# Altium schematic sheet Indictor.SchDoc
size A4
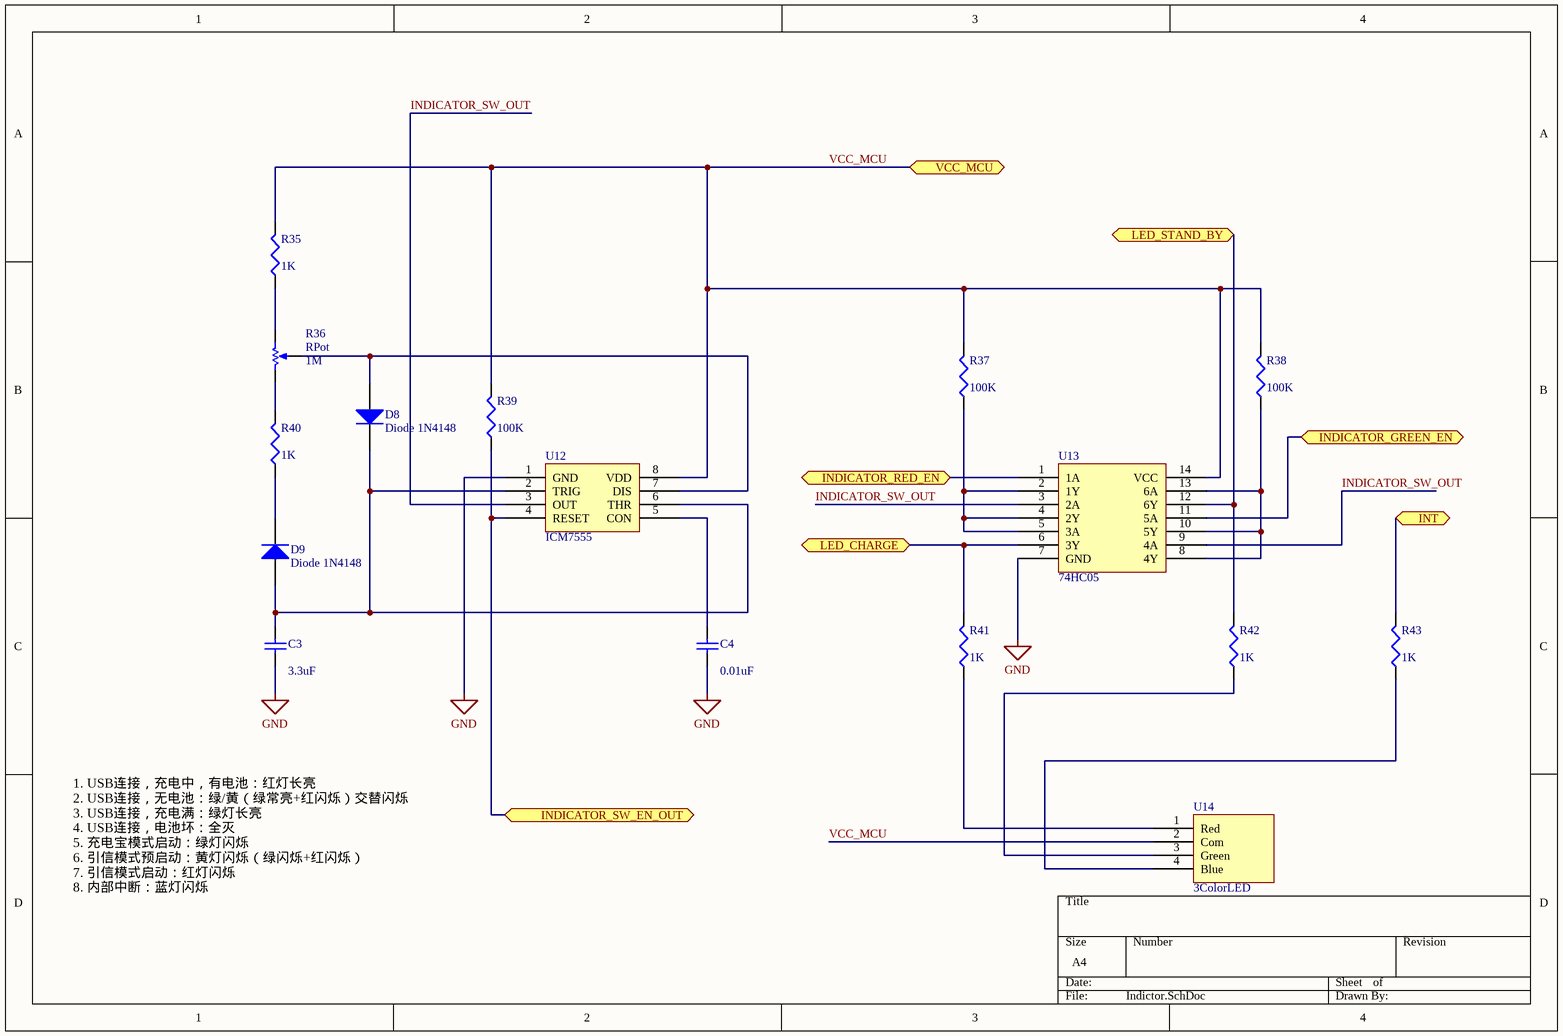
[diagram p0: Indictor.SchDoc]

## Parts
C3  value 3.3uF  [0603]  (hidden comment: Cap Semi)
C4  value 0.01uF  [0603]  (hidden comment: Cap Semi)
D8  Diode 1N4148  [1206D]
D9  Diode 1N4148  [1206D]
R35  value 1K  [0603]  (hidden comment: Res3)
R36  RPot  value 1M  [VR5]
R37  value 100K  [0603]  (hidden comment: Res3)
R38  value 100K  [0603]  (hidden comment: Res3)
R39  value 100K  [0603]  (hidden comment: Res3)
R40  value 1K  [0603]  (hidden comment: Res3)
R41  value 1K  [0603]  (hidden comment: Res3)
R42  value 1K  [0603]  (hidden comment: Res3)
R43  value 1K  [0603]  (hidden comment: Res3)
U12  ICM7555  [SOP8]
U13  74HC05  [TSSOP14]
U14  3ColorLED  [3COLOR-LED]

## Ports
INDICATOR_GREEN_EN (bidir), INDICATOR_RED_EN (bidir), INDICATOR_SW_EN_OUT (bidir), INT (bidir), LED_CHARGE (bidir), LED_STAND_BY (bidir), VCC_MCU (bidir)

## Nets
GND: C3.1 C4.1 U12.1(GND) U13.7(GND)
INDICATOR_GREEN_EN: U13.11(5A) ; port INDICATOR_GREEN_EN
INDICATOR_RED_EN: U13.1(1A) ; port INDICATOR_RED_EN
INDICATOR_SW_EN_OUT: R39.1 U12.4(RESET) ; port INDICATOR_SW_EN_OUT
INDICATOR_SW_OUT: U12.3(OUT) U13.3(2A) U13.9(4A)
INT: R43.2 ; port INT
LED_CHARGE: R41.2 U13.6(3Y) ; port LED_CHARGE
LED_STAND_BY: R42.2 U13.12(6Y) ; port LED_STAND_BY
VCC_MCU: R35.2 R37.2 R38.2 R39.2 U12.8(VDD) U13.14(VCC) U14.2(Com) ; port VCC_MCU
NetC3_2: C3.2 D8.2(K) D9.1(A) U12.2(TRIG) U12.6(THR)
NetC4_2: C4.2 U12.5(CON)
NetD8_1: D8.1(A) R36.3(TAP) U12.7(DIS)
NetD9_2: D9.2(K) R40.1
NetR35_1: R35.1 R36.1(TOP)
NetR36_2: R36.2(BOT) R40.2
NetR37_1: R37.1 U13.2(1Y) U13.4(2Y) U13.5(3A)
NetR38_1: R38.1 U13.8(4Y) U13.10(5Y) U13.13(6A)
NetR41_1: R41.1 U14.1(Red)
NetR42_1: R42.1 U14.3(Green)
NetR43_1: R43.1 U14.4(Blue)

## Notes on the sheet
- 1. USB连接，充电中，有电池：红灯长亮
  2. USB连接，无电池：绿/黄（绿常亮+红闪烁）交替闪烁
  3. USB连接，充电满：绿灯长亮
  4. USB连接，电池坏：全灭
  5. 充电宝模式启动：绿灯闪烁
  6. 引信模式预启动：黄灯闪烁（绿闪烁+红闪烁）
  7. 引信模式启动：红灯闪烁
  8. 内部中断：蓝灯闪烁

## Library data of the parts
C3 C4 = Cap Semi: Capacitor (Semiconductor SIM Model); Published: 8-Jun-2000; LatestRevisionDate: 29-May-2009; LatestRevisionNote: IPC-7351 Footprint Added.; PackageReference: C1206; Publisher: Altium Limited; PackageDescription: Chip Capacitor
D8 D9 = Diode 1N4005: 1 Amp General Purpose Rectifier; Published: 8-Jun-2000; LatestRevisionDate: 17-Jul-2002; LatestRevisionNote: Re-released for DXP Platform.; DatasheetVersion: 1998; PackageVersion: Aug-1999; PackageReference: DO-41; Publisher: Altium Limited; PackageDescription: Diode, Axial; Body 5.2 x 2.7 mm (LxDia. max), Lead Dia. 0.86 mm (max); Code_JEDEC: DO-204-AL; ComponentLink1Description: Manufacturer Link; ComponentLink1URL: http://www.fairchildsemi.com/; ComponentLink2Description: Datasheet; ComponentLink2URL: http://www.fairchildsemi.com/ds/1N%2F1N4001.pdf
R35 R37-R43 = Res3: Resistor; Published: 8-Jun-2000; LatestRevisionDate: 29-May-2009; LatestRevisionNote: IPC-7351 Footprint Added.; PackageReference: J1-0603; Publisher: Altium Limited; PackageDescription: Chip Resistor
R36 = RPot: Potentiometer; Sim Note: Enter the Resistance value and the set point into parameter fields.; Set Position: 0.5; Published: 8-Jun-2000; LatestRevisionDate: 17-Jul-2002; LatestRevisionNote: Re-released for DXP Platform.; PackageReference: VR5; Publisher: Altium Limited; PackageDescription: Variable Resistor, Thru-Hole; 3 Leads